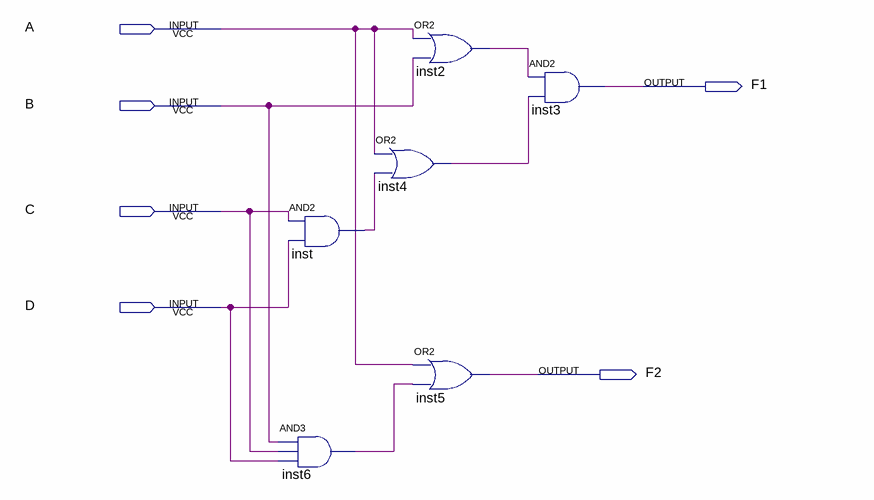
[diagram p0: schematic sheet]
// Quartus schematic week2_1.bdf as structural Verilog: 6 symbols, 6 pins
module week2_1 (
  input  A,
  input  B,
  input  C,
  input  D,
  output F1,
  output F2
);

  wire inst2_out, inst4_out, inst6_out, inst_out;

  and inst (inst_out, C, D);
  and inst6 (inst6_out, B, C, D);
  or inst2 (inst2_out, A, B);
  or inst4 (inst4_out, A, inst_out);
  or inst5 (F2, A, inst6_out);
  and inst3 (F1, inst2_out, inst4_out);
endmodule
